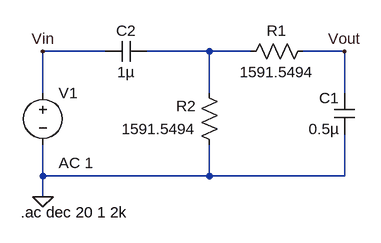
[diagram p0: schematic RC_Bandpass Filter.asc]
RC_Bandpass Filter.asc, the LTspice schematic file:
Version 4
SHEET 1 880 680
WIRE 96 80 0 80
WIRE 256 80 160 80
WIRE 320 80 256 80
WIRE 464 80 400 80
WIRE 0 144 0 80
WIRE 256 144 256 80
WIRE 464 144 464 80
WIRE 0 272 0 224
WIRE 256 272 256 224
WIRE 256 272 0 272
WIRE 464 272 464 208
WIRE 464 272 256 272
WIRE 0 304 0 272
FLAG 0 304 0
FLAG 0 80 Vin
FLAG 464 80 Vout
SYMBOL voltage 0 128 R0
WINDOW 123 24 124 Left 2
WINDOW 39 0 0 Left 0
SYMATTR InstName V1
SYMATTR Value ""
SYMATTR Value2 AC 1
SYMBOL cap 480 208 R180
WINDOW 0 24 56 Left 2
WINDOW 3 24 8 Left 2
SYMATTR InstName C1
SYMATTR Value 0.5µ
SYMBOL cap 160 64 R90
WINDOW 0 0 32 VBottom 2
WINDOW 3 32 32 VTop 2
SYMATTR InstName C2
SYMATTR Value 1µ
SYMBOL res 416 64 R90
WINDOW 0 0 56 VBottom 2
WINDOW 3 32 56 VTop 2
SYMATTR InstName R1
SYMATTR Value 1591.5494
SYMBOL res 272 240 R180
WINDOW 0 36 76 Left 2
WINDOW 3 36 40 Left 2
SYMATTR InstName R2
SYMATTR Value 1591.5494
TEXT -34 328 Left 2 !.ac dec 20 1 2k

The netlist it stands for:
* RC_Bandpass Filter.asc
V1 Vin 0 AC 1
C1 0 Vout 0.5µ
C2 N001 Vin 1µ
R1 Vout N001 1591.5494
R2 0 N001 1591.5494
.ac dec 20 1 2k
.backanno
.end